# EAGLE design Juki_PCB (EAGLE 5.11)

## Sheet 1 of 5
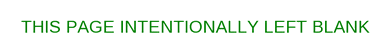
[diagram p0: schematic, sheet 1]

### Notes on the sheet
- THIS PAGE INTENTIONALLY LEFT BLANK

## Sheet 2 of 5
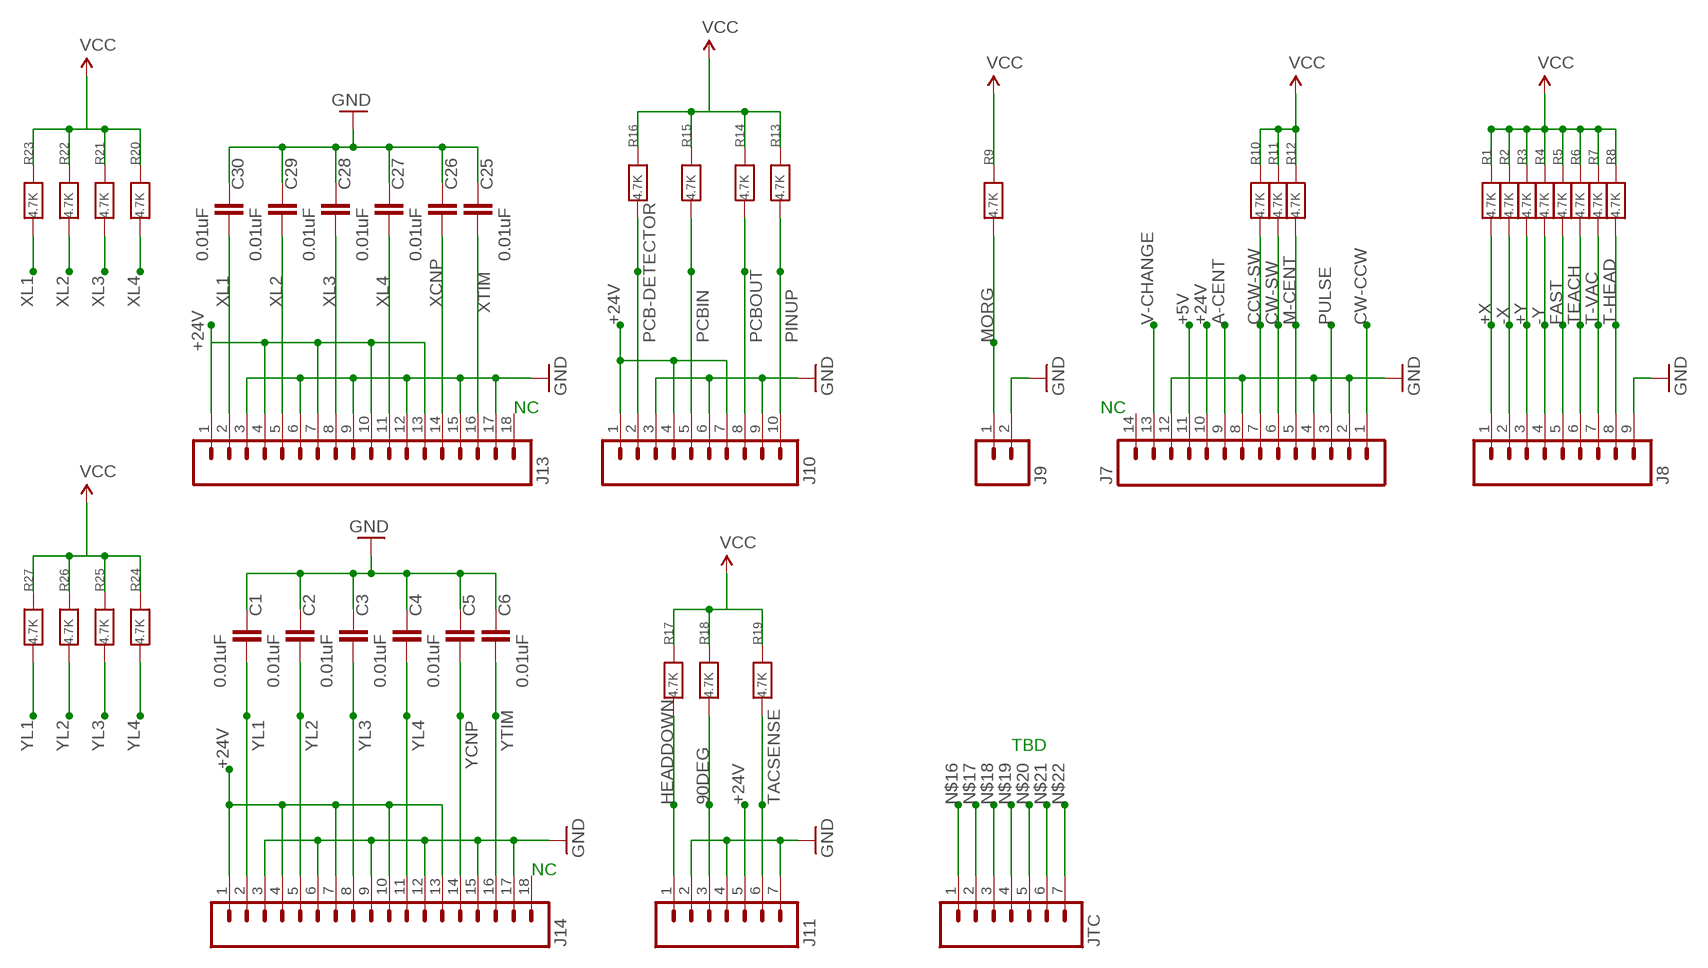
[diagram p1: schematic, sheet 2]

### Parts
C1  0.01uF  CAP0805  [0805]
C2  0.01uF  CAP0805  [0805]
C3  0.01uF  CAP0805  [0805]
C4  0.01uF  CAP0805  [0805]
C5  0.01uF  CAP0805  [0805]
C6  0.01uF  CAP0805  [0805]
C25  0.01uF  CAP0805  [0805]
C26  0.01uF  CAP0805  [0805]
C27  0.01uF  CAP0805  [0805]
C28  0.01uF  CAP0805  [0805]
C29  0.01uF  CAP0805  [0805]
C30  0.01uF  CAP0805  [0805]
J7  M14  [14P]
J8  M09  [09P]
J9  M02  [02P]
J10  M10  [10P]
J11  M07  [07P]
J13  M18  [18P]
J14  M18  [18P]
JTC  M07  [07P]
R1  4.7K  RESISTOR0805  [0805]
R2  4.7K  RESISTOR0805  [0805]
R3  4.7K  RESISTOR0805  [0805]
R4  4.7K  RESISTOR0805  [0805]
R5  4.7K  RESISTOR0805  [0805]
R6  4.7K  RESISTOR0805  [0805]
R7  4.7K  RESISTOR0805  [0805]
R8  4.7K  RESISTOR0805  [0805]
R9  4.7K  RESISTOR0805  [0805]
R10  4.7K  RESISTOR0805  [0805]
R11  4.7K  RESISTOR0805  [0805]
R12  4.7K  RESISTOR0805  [0805]
R13  4.7K  RESISTOR0805  [0805]
R14  4.7K  RESISTOR0805  [0805]
R15  4.7K  RESISTOR0805  [0805]
R16  4.7K  RESISTOR0805  [0805]
R17  4.7K  RESISTOR0805  [0805]
R18  4.7K  RESISTOR0805  [0805]
R19  4.7K  RESISTOR0805  [0805]
R20  4.7K  RESISTOR0805  [0805]
R21  4.7K  RESISTOR0805  [0805]
R22  4.7K  RESISTOR0805  [0805]
R23  4.7K  RESISTOR0805  [0805]
R24  4.7K  RESISTOR0805  [0805]
R25  4.7K  RESISTOR0805  [0805]
R26  4.7K  RESISTOR0805  [0805]
R27  4.7K  RESISTOR0805  [0805]

### Nets
90DEG: J11.3 R18.1
+5V [power]: J7.11 R1.2 R2.2 R3.2 R4.2 R5.2 R6.2 R7.2 R8.2 R9.2 R10.2 R11.2 R12.2 R13.2 R14.2 R15.2 R16.2 R17.2 R18.2 R19.2 R20.2 R21.2 R22.2 R23.2 R24.2 R25.2 R26.2 R27.2 ; supply symbol labelled VCC ; also sheet 3
+24V [power]: J7.10 J10.1 J10.4 J10.7 J11.5 J13.1 J13.4 J13.7 J13.10 J13.13 J14.1 J14.4 J14.7 J14.10 J14.13 ; also sheet 3
+X: J8.1 R1.1
+Y: J8.3 R3.1
-X: J8.2 R2.1
-Y: J8.4 R4.1
A-CENT: J7.9
CCW-SW: J7.7 R10.1
CW-CCW: J7.1
CW-SW: J7.6 R11.1
FAST: J8.5 R5.1
GND: C1.1 C2.1 C3.1 C4.1 C5.1 C6.1 C25.1 C26.1 C27.1 C28.1 C29.1 C30.1 J7.2 J7.4 J7.8 J7.12 J8.9 J9.2 J10.3 J10.6 J10.9 J11.2 J11.4 J11.7 J13.3 J13.6 J13.9 J13.12 J13.15 J13.17 J14.3 J14.6 J14.9 J14.12 J14.15 J14.17 ; also sheet 3,4,5
HEADDOWN: J11.1 R17.1
M-CENT: J7.5 R12.1
MORG: J9.1 R9.1
N$16: JTC.1
N$17: JTC.2
N$18: JTC.3
N$19: JTC.4
N$20: JTC.5
N$21: JTC.6
N$22: JTC.7
PCB-DETECTOR: J10.2 R16.1
PCBIN: J10.5 R15.1
PCBOUT: J10.8 R14.1
PINUP: J10.10 R13.1
PULSE: J7.3
T-HEAD: J8.8 R8.1
T-VAC: J8.7 R7.1
TACSENSE: J11.6 R19.1
TEACH: J8.6 R6.1
V-CHANGE: J7.13
XCNP: C26.2 J13.14
XL1: C30.2 J13.2 R23.1
XL2: C29.2 J13.5 R22.1
XL3: C28.2 J13.8 R21.1
XL4: C27.2 J13.11 R20.1
XTIM: C25.2 J13.16
YCNP: C5.2 J14.14
YL1: C1.2 J14.2 R27.1
YL2: C2.2 J14.5 R26.1
YL3: C3.2 J14.8 R25.1
YL4: C4.2 J14.11 R24.1
YTIM: C6.2 J14.16
Unconnected: J7.14 J13.18 J14.18

### Notes on the sheet
- NC | NC
- TBD
- NC

## Sheet 3 of 5
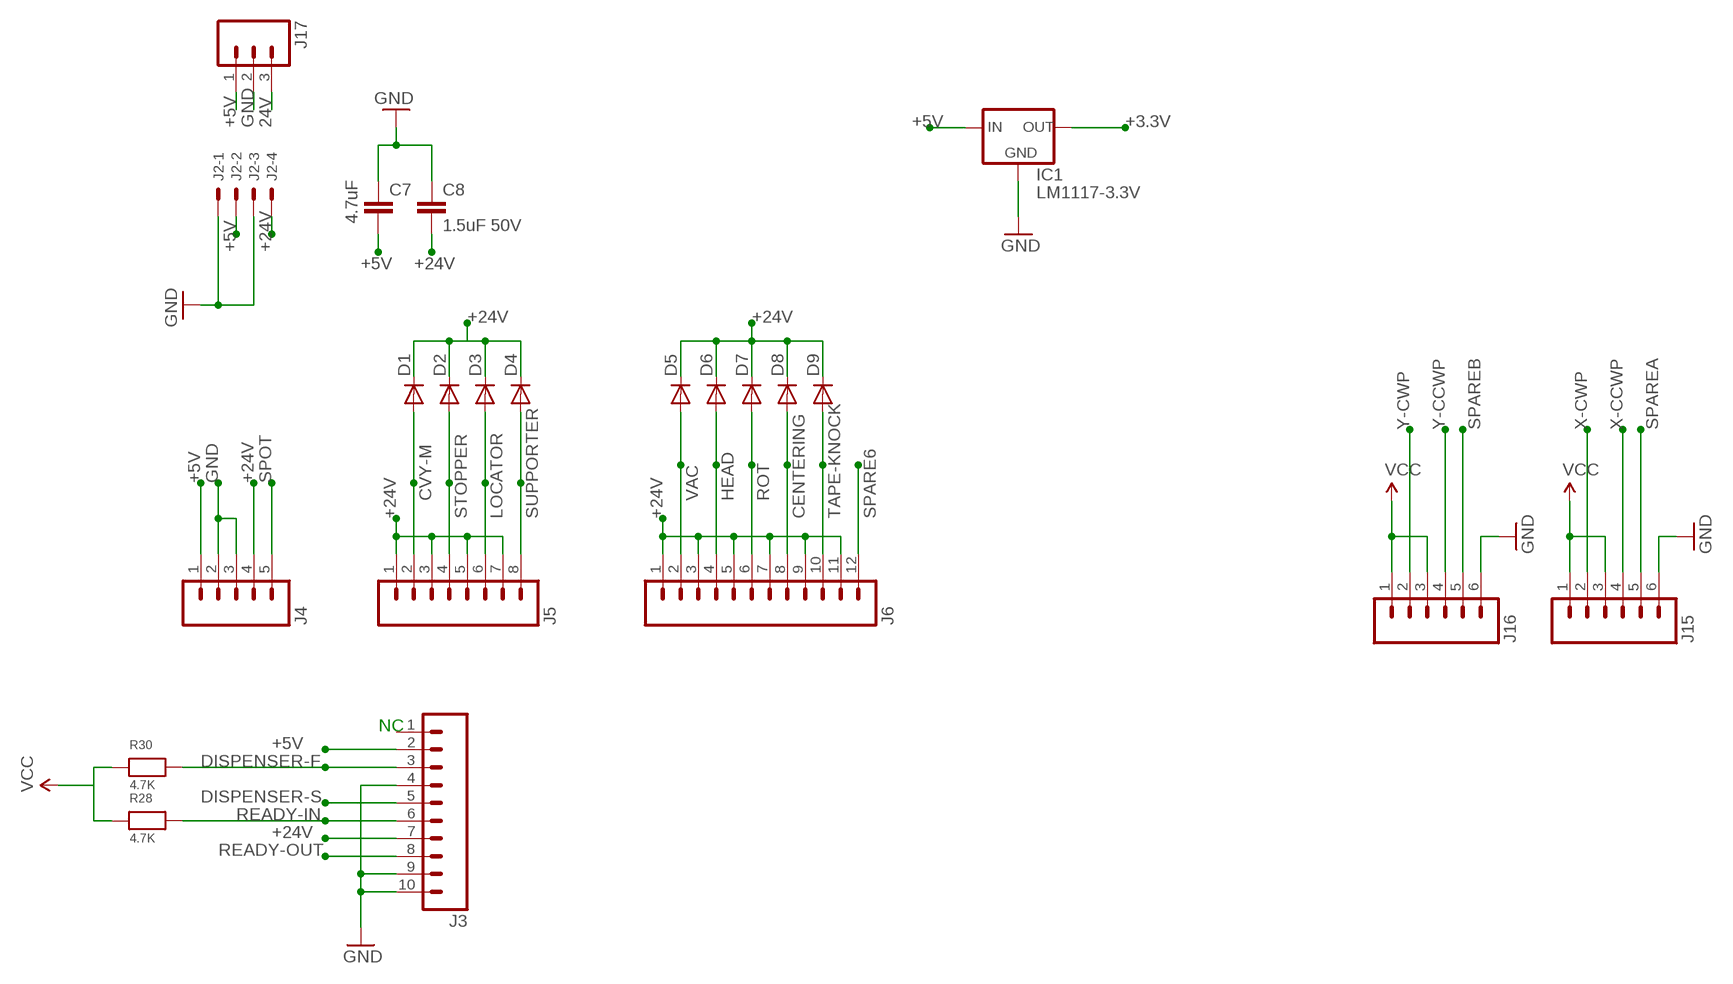
[diagram p2: schematic, sheet 3]

### Parts
C7  4.7uF  CAP0805  [0805]
C8  1.5uF 50V  CAP0805  [0805]
D1  DIODESOD  [SOD-323]
D2  DIODESOD  [SOD-323]
D3  DIODESOD  [SOD-323]
D4  DIODESOD  [SOD-323]
D5  DIODESOD  [SOD-323]
D6  DIODESOD  [SOD-323]
D7  DIODESOD  [SOD-323]
D8  DIODESOD  [SOD-323]
D9  DIODESOD  [SOD-323]
IC1  LM1117-3.3V  LM1117  [SOT223]
J2  KK-156-4  [KK-156-4]
J3  M10  [10P]
J4  M05  [05P]
J5  M08  [08P]
J6  M12  [12P]
J15  M06  [06P]
J16  M06  [06P]
J17  M03  [03P]
R28  4.7K  RESISTOR0805  [0805]
R30  4.7K  RESISTOR0805  [0805]

### Nets
24V: J17.3
+3.3V: IC1.2(OUT) ; also sheet 4
+5V [power]: C7.2 IC1.3(IN) J2.2 J3.2 J4.1 J15.1 J15.3 J16.1 J16.3 J17.1 R28.1 R30.1 ; supply symbol labelled VCC ; also sheet 2
+24V [power]: C8.2 D1.1(C) D2.1(C) D3.1(C) D4.1(C) D5.1(C) D6.1(C) D7.1(C) D8.1(C) D9.1(C) J2.4 J3.7 J4.4 J5.1 J5.3 J5.5 J5.7 J6.1 J6.3 J6.5 J6.7 J6.9 J6.11 ; also sheet 2
CENTERING: D8.2(A) J6.8
CVY-M: D1.2(A) J5.2
DISPENSER-F: J3.3 R30.2
DISPENSER-S: J3.5
GND: C7.1 C8.1 IC1.1(GND) J2.1 J2.3 J3.4 J3.9 J3.10 J4.2 J4.3 J15.6 J16.6 J17.2 ; also sheet 2,4,5
HEAD: D6.2(A) J6.4 ; also sheet 5
LOCATOR: D3.2(A) J5.6
READY-IN: J3.6 R28.2
READY-OUT: J3.8
ROT: D7.2(A) J6.6
SPARE6: J6.12
SPAREA: J15.5
SPAREB: J16.5
SPOT: J4.5
STOPPER: D2.2(A) J5.4
SUPPORTER: D4.2(A) J5.8
TAPE-KNOCK: D9.2(A) J6.10
VAC: D5.2(A) J6.2
X-CCWP: J15.4
X-CWP: J15.2
Y-CCWP: J16.4
Y-CWP: J16.2
Unconnected: J3.1

### Notes on the sheet
- NC

## Sheet 4 of 5
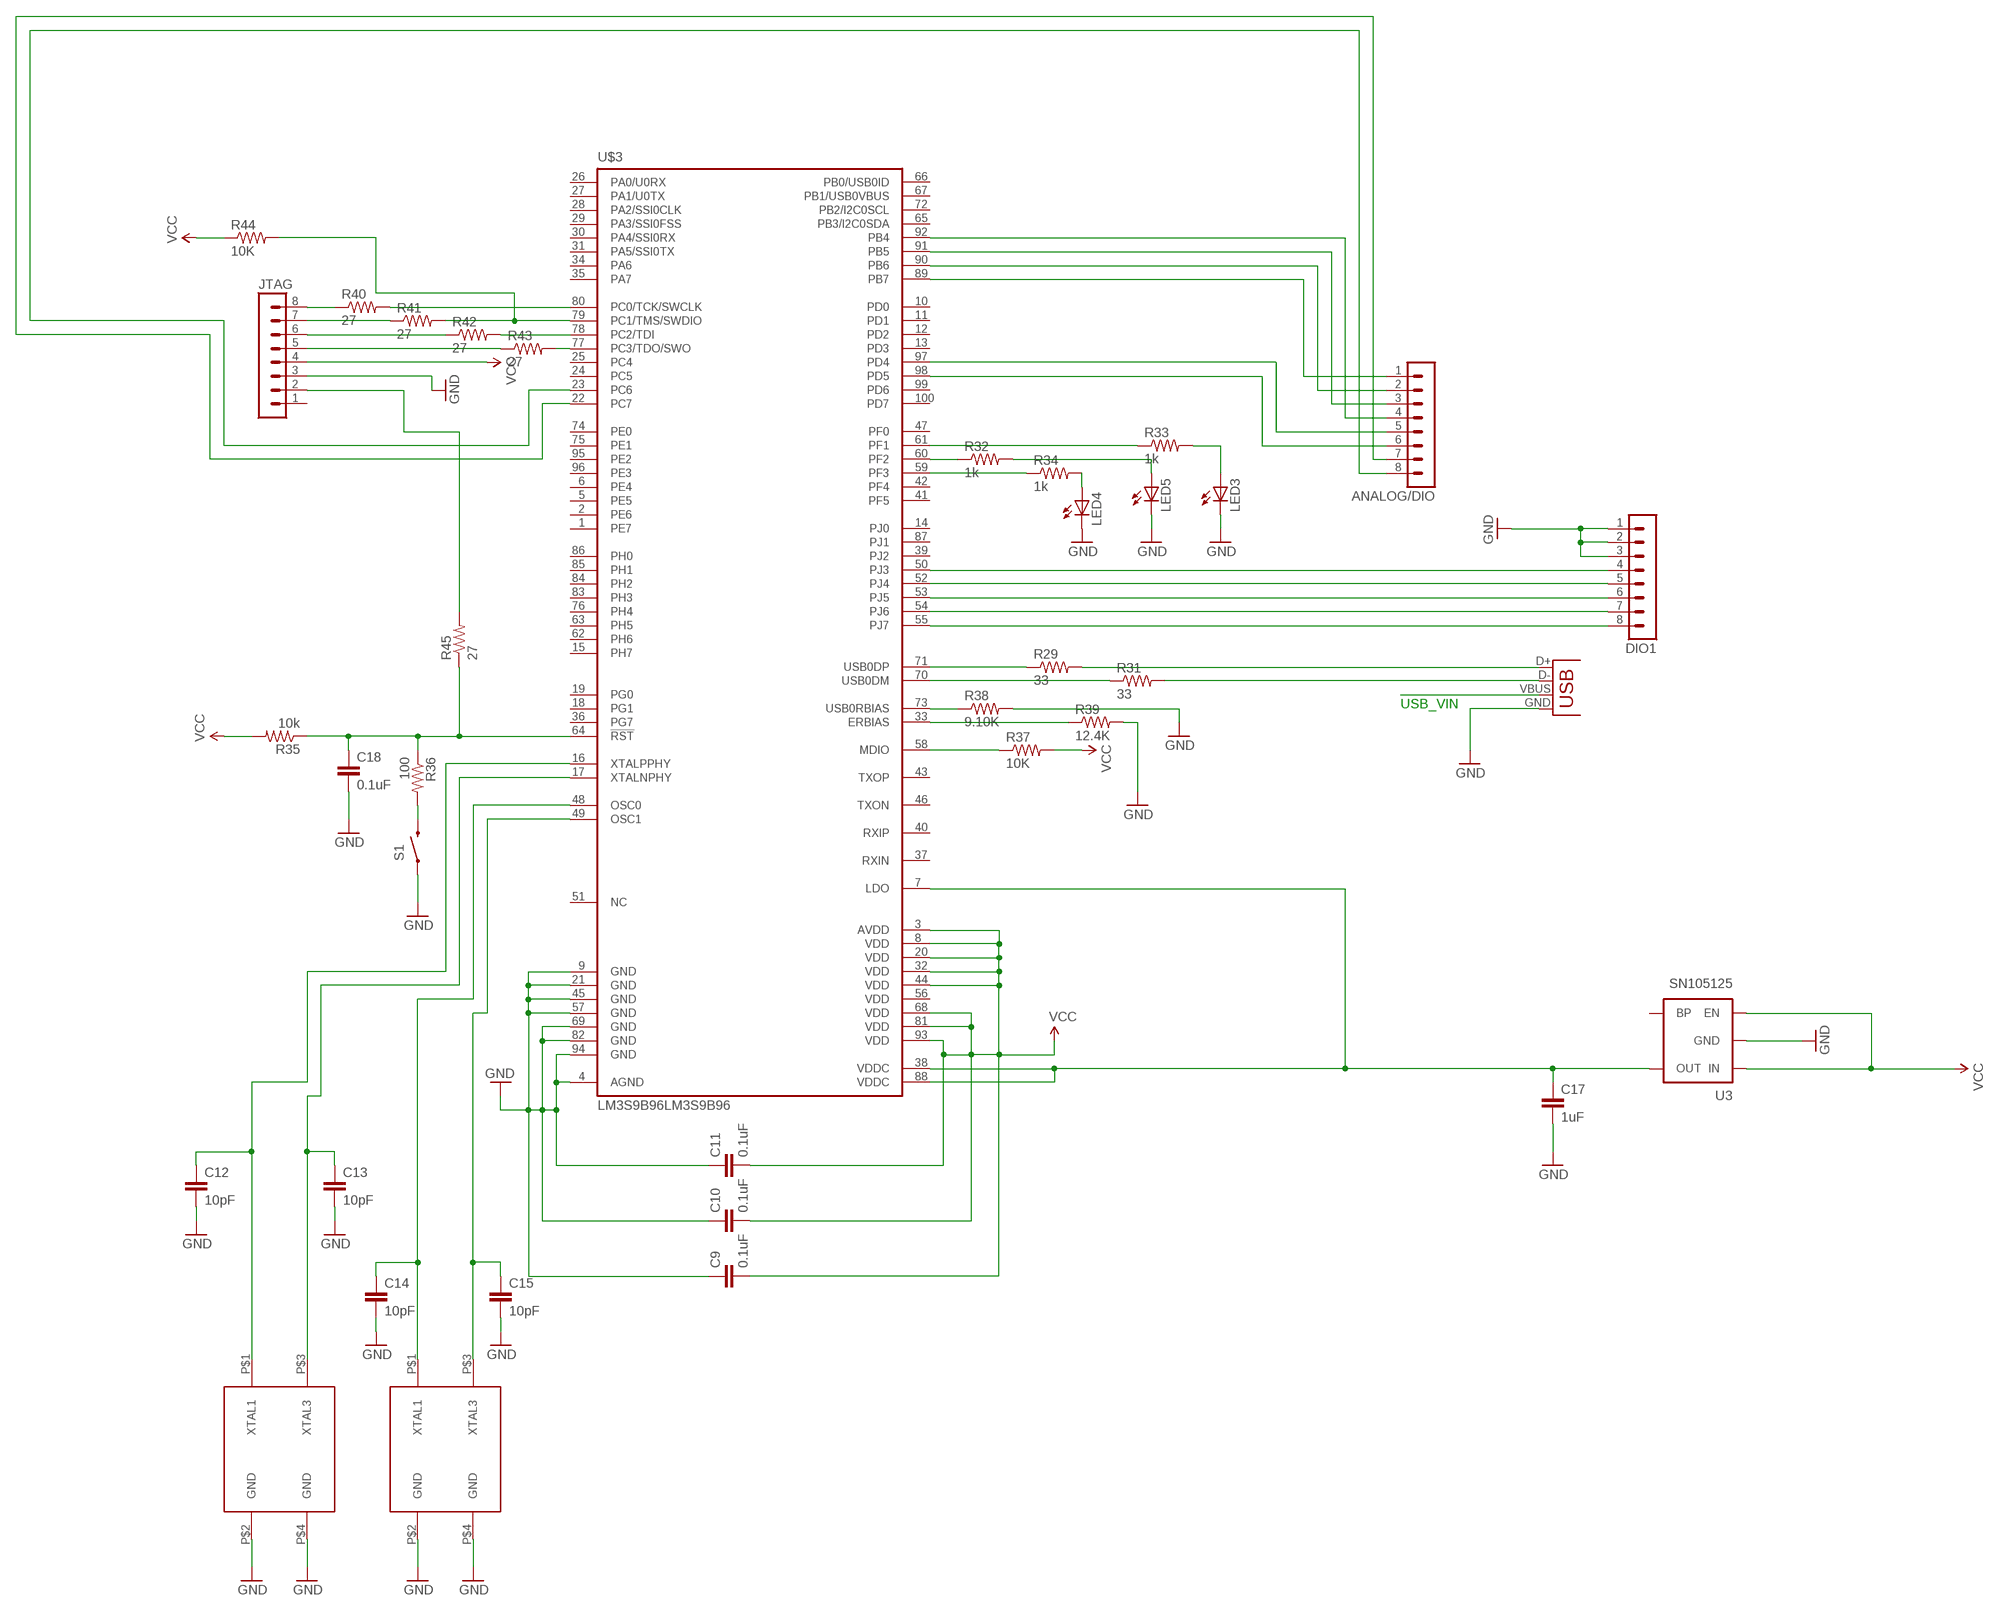
[diagram p3: schematic, sheet 4]

### Parts
16MHZ  16MHz  ABM3G  [ABM3G]
25MHZ  25MHz  ABM3G  [ABM3G]
ANALOG/DIO  MA08-1  [MA08-1]
C9  0.1uF  CAP0805  [0805]
C10  0.1uF  CAP0805  [0805]
C11  0.1uF  CAP0805  [0805]
C12  10pF  CAP0402-CAP  [0402-CAP]
C13  10pF  CAP0402-CAP  [0402-CAP]
C14  10pF  CAP0402-CAP  [0402-CAP]
C15  10pF  CAP0402-CAP  [0402-CAP]
C17  1uF  CAP0805  [0805]
C18  0.1uF  CAP0402-CAP  [0402-CAP]
DIO1  MA08-1  [MA08-1]
JTAG  MA08-1  [MA08-1]
LED3  LED1206  [LED-1206]
LED4  LED1206  [LED-1206]
LED5  LED1206  [LED-1206]
R29  33  RESISTOR0402-RES  [0402-RES]
R31  33  RESISTOR0402-RES  [0402-RES]
R32  1k  RESISTOR0402-RES  [0402-RES]
R33  1k  RESISTOR0402-RES  [0402-RES]
R34  1k  RESISTOR0402-RES  [0402-RES]
R35  10k  RESISTOR0402-RES  [0402-RES]
R36  100  RESISTOR0402-RES  [0402-RES]
R37  10K  RESISTOR0402-RES  [0402-RES]
R38  9.10K  RESISTOR0402-RES  [0402-RES]
R39  12.4K  RESISTOR0402-RES  [0402-RES]
R40  27  RESISTOR0402-RES  [0402-RES]
R41  27  RESISTOR0402-RES  [0402-RES]
R42  27  RESISTOR0402-RES  [0402-RES]
R43  27  RESISTOR0402-RES  [0402-RES]
R44  10K  RESISTOR0402-RES  [0402-RES]
R45  27  RESISTOR0402-RES  [0402-RES]
S1  SWITCH-MOMENTARY-2SMD  [TACTILE_SWITCH_SMD]
U3  SN105125  V_REG_LDOSMD  [SOT23-5]
U$3  LM3S9B96LM3S9B96  [LQFP100]
X2  USBPTH  [USB-B-PTH]

### Nets
+3.3V: C9.2 C10.2 C11.2 JTAG.4 U3.1(IN) U3.3(EN) U$3.3(AVDD) U$3.8(VDD) U$3.20(VDD) U$3.32(VDD) U$3.44(VDD) U$3.68(VDD) U$3.81(VDD) U$3.93(VDD) ; supply symbol labelled VCC ; also sheet 3
GND: 16MHZ.P$2(GND) 16MHZ.P$4(GND) 25MHZ.P$2(GND) 25MHZ.P$4(GND) C9.1 C10.1 C11.1 C12.2 C13.2 C14.2 C15.2 C17.2 C18.2 DIO1.1 DIO1.2 DIO1.3 JTAG.3 LED3.C LED4.C LED5.C R38.2 R39.2 S1.1 U3.2(GND) U$3.4(AGND) U$3.9(GND) U$3.21(GND) U$3.45(GND) U$3.57(GND) U$3.69(GND) U$3.82(GND) U$3.94(GND) X2.GND ; also sheet 2,3,5
N$8: LED3.A R33.2
N$9: R29.1 U$3.71(USB0DP)
N$11: R29.2 X2.D+
N$12: R31.2 X2.D-
N$13: R36.2 S1.3
N$14: C17.1 U3.5(OUT) U$3.7(LDO) U$3.38(VDDC) U$3.88(VDDC)
N$15: R31.1 U$3.70(USB0DM)
N$23: JTAG.8 R40.1
N$24: R40.2 U$3.80(PC0/TCK/SWCLK)
N$25: R41.2 R44.2 U$3.79(PC1/TMS/SWDIO)
N$26: JTAG.7 R41.1
N$27: LED5.A R32.2
N$28: LED4.A R34.2
N$29: JTAG.6 R42.1
N$30: R42.2 U$3.78(PC2/TDI)
N$31: R43.2 U$3.77(PC3/TDO/SWO)
N$32: R38.1 U$3.73(USB0RBIAS)
N$33: 25MHZ.P$1(XTAL1) C12.1 U$3.16(XTALPPHY)
N$34: R37.1 U$3.58(MDIO)
N$35: R39.1 U$3.33(ERBIAS)
N$36: JTAG.5 R43.1
N$37: ANALOG/DIO.7 U$3.22(PC7)
N$40: 25MHZ.P$3(XTAL3) C13.1 U$3.17(XTALNPHY)
N$43: ANALOG/DIO.8 U$3.23(PC6)
N$44: JTAG.2 R45.2
N$47: 16MHZ.P$1(XTAL1) C14.1 U$3.48(OSC0)
N$48: 16MHZ.P$3(XTAL3) C15.1 U$3.49(OSC1)
N$49: DIO1.8 U$3.55(PJ7)
N$50: DIO1.7 U$3.54(PJ6)
N$51: DIO1.6 U$3.53(PJ5)
N$52: DIO1.5 U$3.52(PJ4)
N$53: DIO1.4 U$3.50(PJ3)
N$56: ANALOG/DIO.6 U$3.98(PD5)
N$57: ANALOG/DIO.5 U$3.97(PD4)
N$58: ANALOG/DIO.1 U$3.89(PB7)
N$59: ANALOG/DIO.2 U$3.90(PB6)
N$61: R34.1 U$3.59(PF3)
N$63: R32.1 U$3.60(PF2)
N$64: ANALOG/DIO.3 U$3.91(PB5)
N$66: R33.1 U$3.61(PF1)
N$69: ANALOG/DIO.4 U$3.92(PB4)
N$72: C18.1 R35.1 R36.1 R45.1 U$3.64(!RST!)
USB_VIN: X2.VBUS
VCC: R35.2 R37.2 R44.1
Unconnected: JTAG.1 U3.4(BP) U$3.1(PE7) U$3.2(PE6) U$3.5(PE5) U$3.6(PE4) U$3.10(PD0) U$3.11(PD1) U$3.12(PD2) U$3.13(PD3) U$3.14(PJ0) U$3.15(PH7) U$3.18(PG1) U$3.19(PG0) U$3.24(PC5) U$3.25(PC4) U$3.26(PA0/U0RX) U$3.27(PA1/U0TX) U$3.28(PA2/SSI0CLK) U$3.29(PA3/SSI0FSS) U$3.30(PA4/SSI0RX) U$3.31(PA5/SSI0TX) U$3.34(PA6) U$3.35(PA7) U$3.36(PG7) U$3.37(RXIN) U$3.39(PJ2) U$3.40(RXIP) U$3.41(PF5) U$3.42(PF4) U$3.43(TXOP) U$3.46(TXON) U$3.47(PF0) U$3.51(NC) U$3.62(PH6) U$3.63(PH5) U$3.65(PB3/I2C0SDA) U$3.66(PB0/USB0ID) U$3.67(PB1/USB0VBUS) U$3.72(PB2/I2C0SCL) U$3.74(PE0) U$3.75(PE1) U$3.76(PH4) U$3.83(PH3) U$3.84(PH2) U$3.85(PH1) U$3.86(PH0) U$3.87(PJ1) U$3.95(PE2) U$3.96(PE3) U$3.99(PD6) U$3.100(PD7)

### Notes on the sheet
- USB_VIN

## Sheet 5 of 5
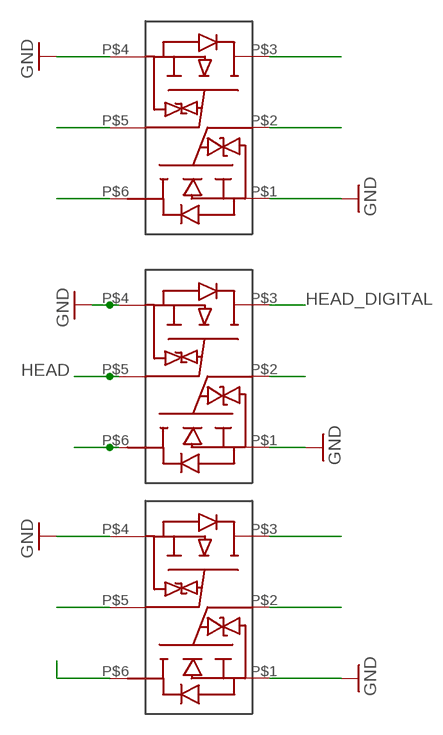
[diagram p4: schematic, sheet 5]

### Parts
U$1  US6K1TR  [TUMT6]
U$2  US6K1TR  [TUMT6]
U$4  US6K1TR  [TUMT6]

### Nets
GND: U$1.P$1 U$1.P$4 U$2.P$1 U$2.P$4 U$4.P$1 U$4.P$4 ; also sheet 2,3,4
HEAD: U$2.P$5 ; also sheet 3
HEAD_DIGITAL: U$2.P$3
N$5: U$1.P$2
N$6: U$2.P$2
N$7: U$1.P$3
N$10: U$2.P$6
N$41: U$4.P$5
N$42: U$4.P$6
N$45: U$4.P$2
N$46: U$4.P$3
N$54: U$1.P$5
N$55: U$1.P$6

## Power pins joined to a net without a drawn wire
VDD: U$3.56(VDD)

## Library data of the parts
16MHZ 25MHZ = ABM3G:ABM3G
ANALOG/DIO DIO1 JTAG = con-lstb:MA08-1: PIN HEADER
C1-C15 C17 C18 C25-C30 = SparkFun:CAP: Capacitor Standard 0603 ceramic capacitor, and 0.1" leaded capacitor.
D1-D9 = SparkFun:DIODE: Diode These are standard reverse protection diodes and small signal diodes. SMA package can handle up to about 1A. SOD-323 can handle about 200mA. What the SOD-323 package when ordering, there are some mfgs out there that are 5-pin packages.
IC1 = v-reg-3:LM1117
J2 = con-molex:KK-156-4: KK 156 HEADER Source: http://www.molex.com/pdm_docs/sd/026604100_sd.pdf; OC_FARNELL: unknown; OC_NEWARK: unknown
J3 J10 = con-amp-quick:M10: AMP QUICK CONNECTOR; OC_FARNELL: unknown; OC_NEWARK: unknown
J4 = con-amp-quick:M05: AMP QUICK CONNECTOR; OC_FARNELL: unknown; OC_NEWARK: unknown
J5 = con-amp-quick:M08: AMP QUICK CONNECTOR; OC_FARNELL: unknown; OC_NEWARK: unknown
J6 = con-amp-quick:M12: AMP QUICK CONNECTOR; OC_FARNELL: unknown; OC_NEWARK: unknown
J7 = con-amp-quick:M14: AMP QUICK CONNECTOR; OC_FARNELL: unknown; OC_NEWARK: unknown
J8 = con-amp-quick:M09: AMP QUICK CONNECTOR; OC_FARNELL: unknown; OC_NEWARK: unknown
J9 = con-amp-quick:M02: AMP QUICK CONNECTOR; OC_FARNELL: unknown; OC_NEWARK: unknown
J11 JTC = con-amp-quick:M07: AMP QUICK CONNECTOR; OC_FARNELL: unknown; OC_NEWARK: unknown
J13 J14 = con-amp-quick:M18: M18P Header
J15 J16 = con-amp-quick:M06: AMP QUICK CONNECTOR; OC_FARNELL: unknown; OC_NEWARK: unknown
J17 = con-amp-quick:M03: AMP QUICK CONNECTOR; OC_FARNELL: unknown; OC_NEWARK: unknown
LED3-LED5 = SparkFun:LED: LEDs Standard schematic elements and footprints for 5mm, 3mm, 1206, and 0603 sized LEDs. 5mm - Spark Fun Electronics SKU : COM-00529 (and others)
R1-R28 R30 = microbuilder:RESISTOR: Resistors 0402 - 0402 Surface Mount Package 10.0K 1% 1/16W [Digikey: 311-10.0KLRTR-ND] 0603 - 0603 Surface Mount Package 0 Ohm 1/10 Watt 1% Resistor 15 Ohm 1/10 Watt 1% Resistor 33 Ohm 1/10 Watt 1% Resistor 49.9 Ohm 1/10 Watt 1% Resistor 100 Ohm 1/10 Watt 1% Resistor 150 Ohm 1/10 Watt 1% Resistor 240 Ohm 1/10 Watt 1% Resistor 390 Ohm 1/10 Watt 1% Resistor 560 Ohm 1/10 Watt 1% Resistor 750 Ohm 1/10 Watt 1% Resistor 1.0K Ohm 1/10 Watt 1% Resistor 1.5K Ohm 1/10 Watt 1% Resistor 2.0K Ohm 1/10 Watt 1% Resistor 4.7K Ohm 1/10 Watt 1% Resistor 10.0K Ohm 1/10 Watt 1% Resistor 20.0K Ohm 1/10 Watt 1% Resistor 33.0K Ohm 1/10 Watt 1% Resistor 100.0K Ohm 1/10 Watt 1% Resistor 0805 - 0805 Surface Mount Package 0 Ohm 1/8 Watt 1% Resistor 33 Ohm 1/8 Watt 1% Resistor 100 Ohm 1/8 Watt 1% Resistor 150 Ohm 1/8 Watt 1% Resistor 200 Ohm 1/8 Watt 1% Resistor 240 Ohm 1/8 Watt 1% Resistor 330 Ohm 1/8 Watt 1% Resistor 390 Ohm 1/8 Watt 1% Resistor 470 Ohm 1/8 Watt 1% Resistor 1.0K Ohm 1/8 Watt 1% Resistor 1.5K Ohm 1/8 Watt 1% Resistor 2.0K Ohm 1/8 Watt 1% Resistor 4.7K Ohm 1/8 Watt 1% Resistor 5.1K Ohm 1/8 Watt 1% Resistor 5.6K Ohm 1/8 Watt 1% Resistor 10.0K Ohm 1/8 Watt 1% Resistor 22.0K Ohm 1/8 Watt 1% Resistor 33.0K Ohm 1/8 Watt 1% Resistor 100K Ohm 1/8 Watt 1% Resistor 1206 - 1206 Surface Mount Package
R29 R31-R45 = SparkFun:RESISTOR: Resistor Basic schematic elements and footprints for 0603, 1206, and PTH resistors.
S1 = SparkFun:SWITCH-MOMENTARY-2
U3 = SparkFun:V_REG_LDO: Voltage Regulator LDO Standard 150mA LDO voltage regulator in SOT-23 layout. Micrel part MIC5205. BP (by-pass) pin is used to lower output noise with 470pF cap.
U$1 U$2 U$4 = Nullspace:US6K1TR: US6K1TR MOSFET
U$3 = luminary-arm:LM3S9B96
X2 = SparkFun:USB: USB Connectors USB-B-PTH is fully proven SKU : PRT-00139 USB-miniB is fully proven SKU : PRT-00587 USB-A-PCB is untested. USB-A-H is throughly reviewed, but untested. Spark Fun Electronics SKU : PRT-00437 USB-B-SMT is throughly reviewed, but untested. Needs silkscreen touching up. USB-A-S has not been used/tested USB-MB-H has not been used/tested

## Net classes
0 default: width 0.254 mm
1 power: width 0.635 mm

## Board
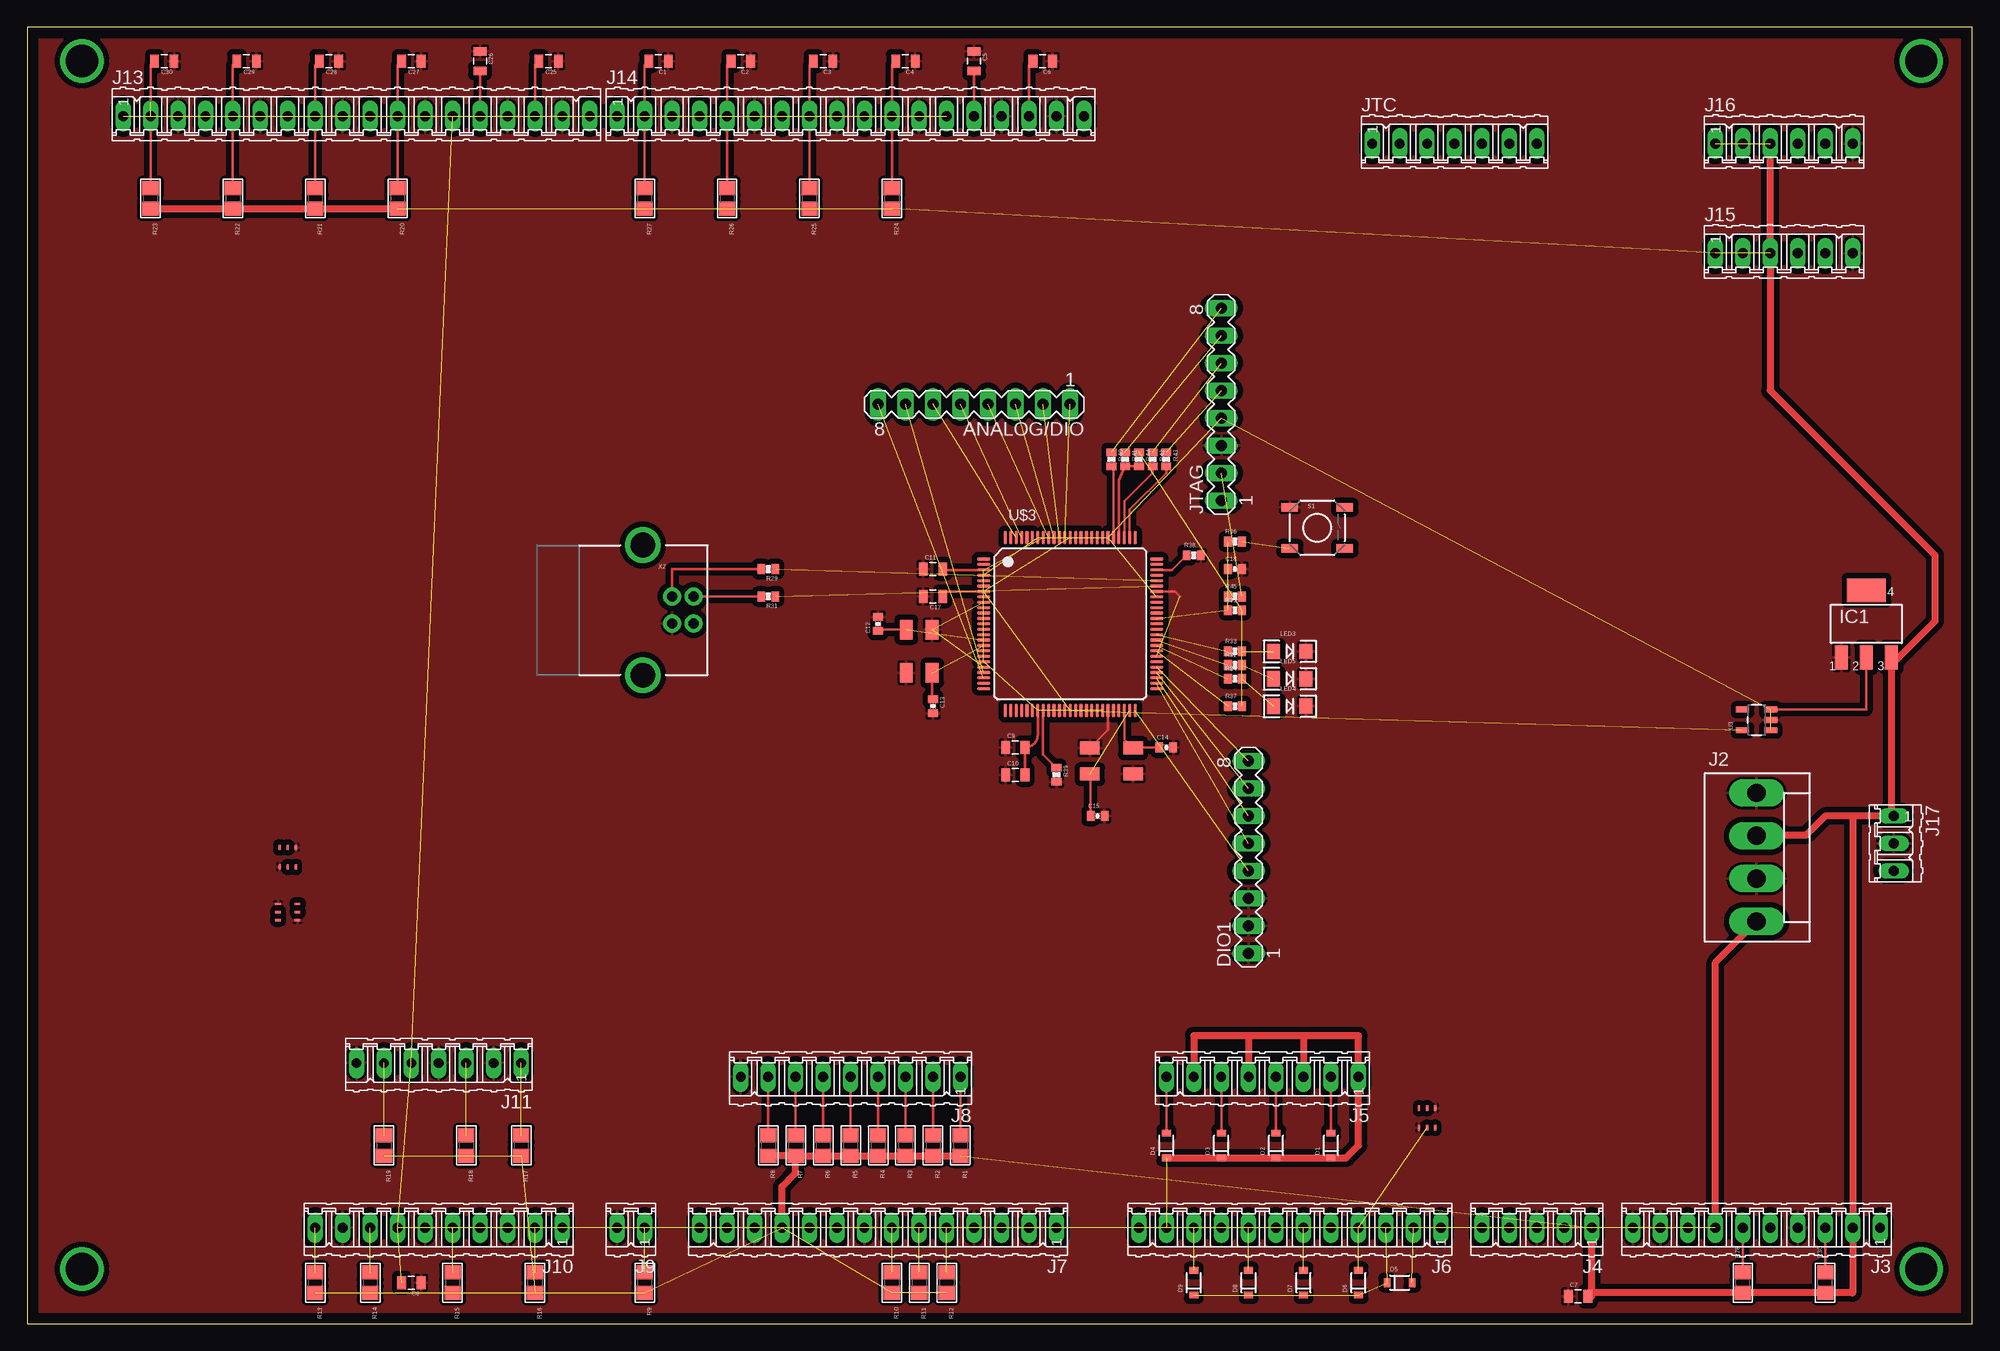
[diagram p5: board, top side]

Size 180 x 120 mm. Coordinates in mm from the lower left corner, seen from the top.
Outline: 0,0 180,0 180,120 0,120 0,0
Copper layers (1*16): Top 0.035mm / dielectric 1.5mm / Bottom 0.035mm
Design rules "default": minimum track width 10mil, minimum drill 24mil, track to track 8mil, track to pad 8mil, pad to pad 8mil, via to via 8mil, smd to smd 8mil, copper to edge 40mil, drill to drill 8mil, minimum pad ring 10mil, minimum via ring 8mil, stop-mask expansion 4mil, vias tented up to drill 0mil, thermal gap 10mil

### Footprints (pad centres in the part's own frame; a part is rotated, then mirrored left to right if it is on the bottom)
ABM3G = smd 1.8 x 1.2: P$1 2,1.2; P$2 -2,1.2; P$3 -2,-1.2; P$4 2,-1.2
MA08-1 = drill 1.016 long: 1 -8.89,0; 2 -6.35,0; 3 -3.81,0; 4 -1.27,0; 5 1.27,0; 6 3.81,0; 7 6.35,0; 8 8.89,0
0805 = smd 0.8 x 1.2: 1 -0.9,0; 2 0.9,0
0402-CAP = smd 0.7 x 0.9: 1 -0.65,0; 2 0.65,0
SOD-323 = smd 0.63 x 0.83: 1 -1.15,0; 2 1.15,0
SOT223 = smd 1.219 x 2.235: 1 -2.311,-3.099; 2 0,-3.099; 3 2.311,-3.099 | smd 3.6 x 2.2: 4 0,3.099
KK-156-4 = drill 1.7 pad 2.184 long: 1 -5.94,0; 2 -1.98,0; 3 1.98,0; 4 5.94,0
10P = drill 0.914 long: 1 -11.43,0; 2 -8.89,0; 3 -6.35,0; 4 -3.81,0; 5 -1.27,0; 6 1.27,0; 7 3.81,0; 8 6.35,0; 9 8.89,0; 10 11.43,0
05P = drill 0.914 long: 1 -5.08,0; 2 -2.54,0; 3 0,0; 4 2.54,0; 5 5.08,0
08P = drill 0.914 long: 1 -8.89,0; 2 -6.35,0; 3 -3.81,0; 4 -1.27,0; 5 1.27,0; 6 3.81,0; 7 6.35,0; 8 8.89,0
12P = drill 0.914 long: 1 -13.97,0; 2 -11.43,0; 3 -8.89,0; 4 -6.35,0; 5 -3.81,0; 6 -1.27,0; 7 1.27,0; 8 3.81,0; 9 6.35,0; 10 8.89,0; 11 11.43,0; 12 13.97,0
14P = drill 0.914 long: 1 -16.51,0; 2 -13.97,0; 3 -11.43,0; 4 -8.89,0; 5 -6.35,0; 6 -3.81,0; 7 -1.27,0; 8 1.27,0; 9 3.81,0; 10 6.35,0; 11 8.89,0; 12 11.43,0; 13 13.97,0; 14 16.51,0
09P = drill 0.914 long: 1 -10.16,0; 2 -7.62,0; 3 -5.08,0; 4 -2.54,0; 5 0,0; 6 2.54,0; 7 5.08,0; 8 7.62,0; 9 10.16,0
02P = drill 0.914 long: 1 -1.27,0; 2 1.27,0
07P = drill 0.914 long: 1 -7.62,0; 2 -5.08,0; 3 -2.54,0; 4 0,0; 5 2.54,0; 6 5.08,0; 7 7.62,0
18P = drill 0.914 long: 1 -21.59,0; 2 -19.05,0; 3 -16.51,0; 4 -13.97,0; 5 -11.43,0; 6 -8.89,0; 7 -6.35,0; 8 -3.81,0; 9 -1.27,0; 10 1.27,0; 11 3.81,0; 12 6.35,0; 13 8.89,0; 14 11.43,0; 15 13.97,0; 16 16.51,0; 17 19.05,0; 18 21.59,0
06P = drill 0.914 long: 1 -6.35,0; 2 -3.81,0; 3 -1.27,0; 4 1.27,0; 5 3.81,0; 6 6.35,0
03P = drill 0.914 long: 1 -2.54,0; 2 0,0; 3 2.54,0
LED-1206 = smd 1.2 x 1.4: A -1.5,0; C 1.5,0
0805' = smd 1.3 x 1.5: 1 -0.95,0; 2 0.95,0
0402-RES = smd 0.7 x 0.9: 1 -0.65,0; 2 0.65,0
TACTILE_SWITCH_SMD = smd 1.524 x 0.762: 1 -2.54,1.905; 2 2.54,1.905; 3 -2.54,-1.905; 4 2.54,-1.905
SOT23-5 = smd 0.55 x 1.2: 1 -0.95,-1.3; 2 0,-1.3; 3 0.95,-1.3; 4 0.95,1.3; 5 -0.95,1.3
TUMT6 = smd 0.2 x 0.5: P$1 -0.75,-0.9; P$2 0,-0.9; P$3 0.75,-0.9; P$4 0.75,0.9; P$5 0,0.9; P$6 -0.75,0.9
LQFP100 = smd 0.3 x 1.25: 1 -6,-8; 2 -5.5,-8; 3 -5,-8; 4 -4.5,-8; 5 -4,-8; 6 -3.5,-8; 7 -3,-8; 8 -2.5,-8; 9 -2,-8; 10 -1.5,-8; 11 -1,-8; 12 -0.5,-8; 13 0,-8; 14 0.5,-8; 15 1,-8; 16 1.5,-8; 17 2,-8; 18 2.5,-8; 19 3,-8; 20 3.5,-8; 21 4,-8; 22 4.5,-8; 23 5,-8; 24 5.5,-8; 25 6,-8; 51 6,8; 52 5.5,8; 53 5,8; 54 4.5,8; 55 4,8; 56 3.5,8; 57 3,8; 58 2.5,8; 59 2,8; 60 1.5,8; 61 1,8; 62 0.5,8; 63 0,8; 64 -0.5,8; 65 -1,8; 66 -1.5,8; 67 -2,8; 68 -2.5,8; 69 -3,8; 70 -3.5,8; 71 -4,8; 72 -4.5,8; 73 -5,8; 74 -5.5,8; 75 -6,8 | smd 1.25 x 0.3: 26 8,-6; 27 8,-5.5; 28 8,-5; 29 8,-4.5; 30 8,-4; 31 8,-3.5; 32 8,-3; 33 8,-2.5; 34 8,-2; 35 8,-1.5; 36 8,-1; 37 8,-0.5; 38 8,0; 39 8,0.5; 40 8,1; 41 8,1.5; 42 8,2; 43 8,2.5; 44 8,3; 45 8,3.5; 46 8,4; 47 8,4.5; 48 8,5; 49 8,5.5; 50 8,6; 76 -8,6; 77 -8,5.5; 78 -8,5; 79 -8,4.5; 80 -8,4; 81 -8,3.5; 82 -8,3; 83 -8,2.5; 84 -8,2; 85 -8,1.5; 86 -8,1; 87 -8,0.5; 88 -8,0; 89 -8,-0.5; 90 -8,-1; 91 -8,-1.5; 92 -8,-2; 93 -8,-2.5; 94 -8,-3; 95 -8,-3.5; 96 -8,-4; 97 -8,-4.5; 98 -8,-5; 99 -8,-5.5; 100 -8,-6
USB-B-PTH = drill 0.914 pad 1.676 round: D+ 0,1.25; D- 1.981,1.25; GND 0,-1.25; VBUS 1.981,-1.25 | drill 2.286 round: P$1 -2.718,-6.02; P$2 -2.718,6.02

### Placement (x,y rotation side)
16MHZ  100.33,52.07 0 top
25MHZ  82.55,62.23 90 top
ANALOG/DIO  87.63,85.09 180 top
C1  58.42,116.84 180 top
C2  66.04,116.84 180 top
C3  73.66,116.84 180 top
C4  81.28,116.84 180 top
C5  87.63,116.84 270 top
C6  93.98,116.84 180 top
C7  143.51,2.54 0 top
C8  35.56,3.81 180 top
C9  91.44,53.34 0 top
C10  91.44,50.8 0 top
C11  83.82,69.85 0 top
C12  78.74,64.77 90 top
C13  83.82,57.15 270 top
C14  105.41,53.34 0 top
C15  99.06,46.99 0 top
C17  83.82,67.31 180 top
C18  111.76,69.85 0 top
C25  48.26,116.84 180 top
C26  41.91,116.84 270 top
C27  35.56,116.84 180 top
C28  27.94,116.84 180 top
C29  20.32,116.84 180 top
C30  12.7,116.84 180 top
D1  120.65,16.51 90 top
D2  115.57,16.51 90 top
D3  110.49,16.51 90 top
D4  105.41,16.51 90 top
D5  127,3.81 0 top
D6  123.19,3.81 90 top
D7  118.11,3.81 90 top
D8  113.03,3.81 90 top
D9  107.95,3.81 90 top
DIO1  113.03,43.18 90 top
IC1  170.18,64.77 0 top
J2  160.02,43.18 270 top
J3  160.02,8.89 180 top
J4  139.7,8.89 180 top
J5  114.3,22.86 180 top
J6  116.84,8.89 180 top
J7  78.74,8.89 180 top
J8  76.2,22.86 180 top
J9  55.88,8.89 180 top
J10  38.1,8.89 180 top
J11  38.1,24.13 180 top
J13  30.48,111.76 0 top
J14  76.2,111.76 0 top
J15  162.56,99.06 0 top
J16  162.56,109.22 0 top
J17  172.72,44.45 270 top
JTAG  110.49,85.09 90 top
JTC  132.08,109.22 0 top
LED3  116.84,62.23 0 top
LED4  116.84,57.15 0 top
LED5  116.84,59.69 0 top
R1  4.7K  [0805']  86.36,16.51 270 top
R2  4.7K  [0805']  83.82,16.51 270 top
R3  4.7K  [0805']  81.28,16.51 270 top
R4  4.7K  [0805']  78.74,16.51 270 top
R5  4.7K  [0805']  76.2,16.51 270 top
R6  4.7K  [0805']  73.66,16.51 270 top
R7  4.7K  [0805']  71.12,16.51 270 top
R8  4.7K  [0805']  68.58,16.51 270 top
R9  4.7K  [0805']  57.15,3.81 270 top
R10  4.7K  [0805']  80.01,3.81 270 top
R11  4.7K  [0805']  82.55,3.81 270 top
R12  4.7K  [0805']  85.09,3.81 270 top
R13  4.7K  [0805']  26.67,3.81 270 top
R14  4.7K  [0805']  31.75,3.81 270 top
R15  4.7K  [0805']  39.37,3.81 270 top
R16  4.7K  [0805']  46.99,3.81 270 top
R17  4.7K  [0805']  45.72,16.51 270 top
R18  4.7K  [0805']  40.64,16.51 270 top
R19  4.7K  [0805']  33.02,16.51 270 top
R20  4.7K  [0805']  34.29,104.14 270 top
R21  4.7K  [0805']  26.67,104.14 270 top
R22  4.7K  [0805']  19.05,104.14 270 top
R23  4.7K  [0805']  11.43,104.14 270 top
R24  4.7K  [0805']  80.01,104.14 270 top
R25  4.7K  [0805']  72.39,104.14 270 top
R26  4.7K  [0805']  64.77,104.14 270 top
R27  4.7K  [0805']  57.15,104.14 270 top
R28  4.7K  [0805']  158.75,3.81 90 top
R29  68.58,69.85 180 top
R30  4.7K  [0805']  166.37,3.81 90 top
R31  68.58,67.31 180 top
R32  111.76,60.96 0 top
R33  111.76,62.23 0 top
R34  111.76,59.69 0 top
R35  111.76,66.04 0 top
R36  111.76,72.39 0 top
R37  111.76,57.15 0 top
R38  107.95,71.12 0 top
R39  95.25,50.8 270 top
R40  100.33,80.01 270 top
R41  101.6,80.01 270 top
R42  104.14,80.01 270 top
R43  105.41,80.01 270 top
R44  102.87,80.01 270 top
R45  111.76,67.31 0 top
S1  119.38,73.66 0 top
U3  160.02,55.88 90 top
U$1  24.13,43.18 0 top
U$2  129.54,19.05 180 top
U$3  96.52,64.77 270 top
U$4  24.13,38.1 90 top
X2  59.69,66.04 0 top

### Tracks (layer width: path | path; a pad name or v marks a point on that pad's centre or on a via)
90DEG  (1 unrouted)
+3.3V  (10 unrouted)
  Top 0.254: C10.2 C9.2 arc90 93.52,54.52 U$3.32 | U$3.3 84.8,69.77 arc-90 C11.2 | IC1.2 170.18,56.83 U3.3
+5V  (19 unrouted)
  Top 0.635: J16.3 J15.3 161.29,86.36 176.53,71.12 176.53,65 172.49,60.96 | R23.2 R22.2 R21.2 R20.2 | R7.2 71.12,13.97 69.85,12.7 J7.11 | R7.2 R8.2 | R7.2 R6.2 R5.2 R4.2 R3.2 R2.2 R1.2 | 172.49,60.96 172.49,46.99 J17.1 168.91,46.99 | 172.49,60.96 IC1.3 | J2.2 160.07,45.21 164.59,45.21 166.37,46.99 168.91,46.99 | 168.91,46.99 J3.2 168.91,2.86 R30.1 R28.1 144.41,2.86 C7.2 144.78,2.54 J4.1
+24V  (29 unrouted)
  Top 0.635: D4.1 D3.1 D2.1 D1.1 122.04,15.36 123.19,16.51 J5.1 123.19,26.67 118.11,26.67 | J5.7 107.95,26.67 113.03,26.67 | 113.03,26.67 J5.5 | 118.11,26.67 J5.3 | 118.11,26.67 113.03,26.67 | J2.4 156.21,33.43 J3.7
+X
  Top 0.254: R1.1 J8.1
+Y
  Top 0.254: R3.1 J8.3
-X
  Top 0.254: R2.1 J8.2
-Y
  Top 0.254: R4.1 J8.4
CCW-SW  (1 unrouted)
CENTERING  (1 unrouted)
CVY-M
  Top 0.254: D1.2 J5.2
CW-SW  (1 unrouted)
DISPENSER-F
  Top 0.254: R30.2 J3.3
FAST
  Top 0.254: R5.1 J8.5
GND  (6 unrouted)
  Top 0.254: U$3.69 106.22,67.77 106.68,67.31 | U$3.45 100.02,54.96 16MHZ.P$2
  pour Top (isolate 0.508): 180.34,119.38 0,119.38 0,0 180.34,0
HEAD  (2 unrouted)
HEADDOWN  (1 unrouted)
LOCATOR
  Top 0.254: D3.2 J5.6
M-CENT  (1 unrouted)
MORG  (1 unrouted)
N$1  (via drill 3)
  other vias: 175.26,5.08
N$2  (via drill 3)
  other vias: 5.08,5.08
N$3  (via drill 3)
  other vias: 5.08,116.84
N$4  (via drill 3)
  other vias: 175.26,116.84
N$8  (1 unrouted)
N$9  (1 unrouted)
N$11
  Top 0.254: X2.D+ 59.69,69.85 R29.2
N$12
  Top 0.254: X2.D- 61.67,67.31 R31.2
N$13  (1 unrouted)
N$14  (3 unrouted)
  Top 0.254: U$3.7 85.18,67.77 arc90 C17.1
N$15  (1 unrouted)
N$23  (1 unrouted)
N$24
  Top 0.254: U$3.80 100.52,79.17 R40.2
N$25
  Top 0.254: U$3.79 101.02,78.09 R41.2 R44.2
N$26  (1 unrouted)
N$27  (1 unrouted)
N$28  (1 unrouted)
N$29  (1 unrouted)
N$30
  Top 0.254: U$3.78 101.52,76.12 104.14,78.74 R42.2
N$31
  Top 0.254: U$3.77 102.02,75.35 105.41,78.74 R43.2
N$32
  Top 0.254: U$3.73 105.95,69.77 R38.1
N$33  (1 unrouted)
  Top 0.254: C12.1 78.74,64.23 25MHZ.P$1
N$34  (1 unrouted)
N$35
  Top 0.254: U$3.33 94.02,52.68 R39.1
N$36  (1 unrouted)
N$37  (1 unrouted)
N$40  (1 unrouted)
  Top 0.254: 25MHZ.P$3 83.75,57.8 C13.1
N$43  (1 unrouted)
N$44  (1 unrouted)
N$47
  Top 0.254: U$3.48 101.52,54.08 16MHZ.P$1 102.4,53.34 C14.1
N$48  (1 unrouted)
  Top 0.254: C15.1 98.41,50.79 16MHZ.P$3
N$49  (1 unrouted)
N$50  (1 unrouted)
N$51  (1 unrouted)
N$52  (1 unrouted)
N$53  (1 unrouted)
N$56  (1 unrouted)
N$57  (1 unrouted)
N$58  (1 unrouted)
N$59  (1 unrouted)
N$61  (1 unrouted)
N$63  (1 unrouted)
N$64  (1 unrouted)
N$66  (1 unrouted)
N$69  (1 unrouted)
N$72  (4 unrouted)
PCB-DETECTOR  (1 unrouted)
PCBIN  (1 unrouted)
PCBOUT  (1 unrouted)
PINUP  (1 unrouted)
READY-IN
  Top 0.254: R28.2 J3.6
ROT  (1 unrouted)
STOPPER
  Top 0.254: D2.2 J5.4
SUPPORTER
  Top 0.254: D4.2 J5.8
T-HEAD
  Top 0.254: R8.1 J8.8
T-VAC
  Top 0.254: R7.1 J8.7
TACSENSE  (1 unrouted)
TAPE-KNOCK  (1 unrouted)
TEACH
  Top 0.254: R6.1 J8.6
VAC  (1 unrouted)
VCC  (2 unrouted)
XCNP
  Top 0.254: J13.14 C26.2
XL1  (1 unrouted)
  Top 0.254: C30.2 11.43,116.47 11.43,113.03 | R23.1 J13.2
XL2
  Top 0.254: C29.2 19.05,116.47 J13.5 R22.1
XL3
  Top 0.254: C28.2 26.67,116.47 J13.8 R21.1
XL4
  Top 0.254: C27.2 34.29,116.47 J13.11 R20.1
XTIM
  Top 0.254: J13.16 46.99,116.47 C25.2
YCNP
  Top 0.254: J14.14 C5.2
YL1
  Top 0.254: C1.2 57.15,116.47 J14.2 R27.1
YL2
  Top 0.254: R26.1 J14.5 64.77,116.47 C2.2
YL3
  Top 0.254: R25.1 J14.8 72.39,116.47 C3.2
YL4
  Top 0.254: R24.1 J14.11 80.01,116.47 C4.2
YTIM
  Top 0.254: C6.2 92.71,116.47 J14.16